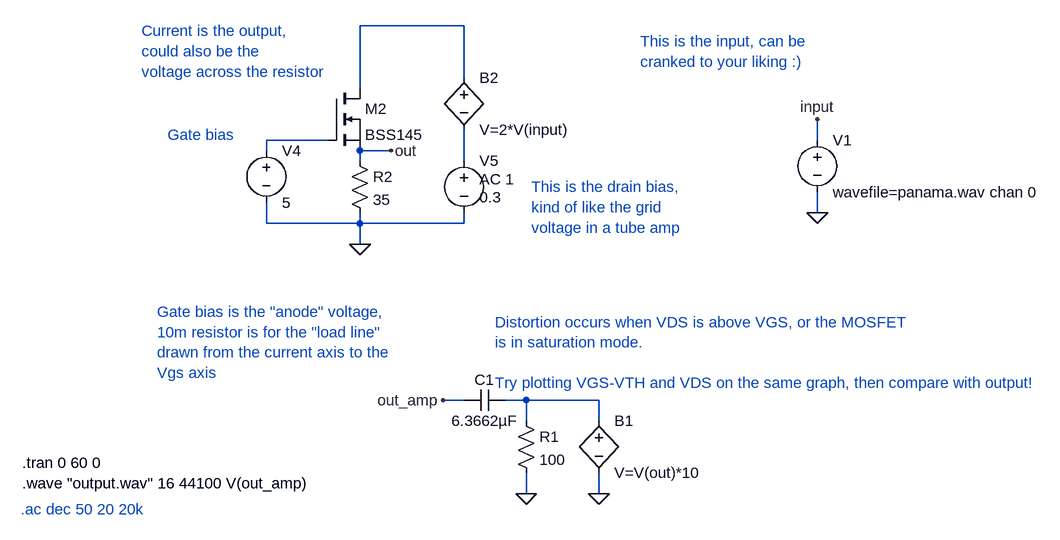
[diagram p0: schematic BSS145.asc]
BSS145.asc, the LTspice schematic file:
Version 4
SHEET 1 2308 808
WIRE 1360 48 1200 48
WIRE 1360 128 1360 48
WIRE 1200 144 1200 48
WIRE 1152 224 1056 224
WIRE 1904 224 1904 192
WIRE 1056 240 1056 224
WIRE 1248 240 1200 240
WIRE 1200 256 1200 240
WIRE 1360 256 1360 208
WIRE 1904 336 1904 304
WIRE 1056 352 1056 320
WIRE 1200 352 1200 336
WIRE 1200 352 1056 352
WIRE 1360 352 1360 336
WIRE 1360 352 1200 352
WIRE 1200 384 1200 352
WIRE 1360 624 1328 624
WIRE 1456 624 1424 624
WIRE 1568 624 1456 624
WIRE 1456 656 1456 624
WIRE 1568 656 1568 624
WIRE 1456 768 1456 736
WIRE 1568 768 1568 736
FLAG 1200 384 0
FLAG 1248 240 out
FLAG 1568 768 0
FLAG 1328 624 out_amp
FLAG 1456 768 0
FLAG 1904 336 0
FLAG 1904 192 input
SYMBOL nmos 1152 144 R0
SYMATTR InstName M2
SYMATTR Value BSS145
SYMBOL voltage 1056 224 R0
WINDOW 123 0 0 Left 0
WINDOW 39 0 0 Left 0
SYMATTR InstName V4
SYMATTR Value 5
SYMBOL voltage 1360 240 R0
WINDOW 123 24 44 Left 2
WINDOW 39 0 0 Left 0
WINDOW 3 24 72 Left 2
SYMATTR Value2 AC 1
SYMATTR Value 0.3
SYMATTR InstName V5
SYMBOL res 1184 240 R0
SYMATTR InstName R2
SYMATTR Value 35
SYMBOL bv 1568 640 R0
SYMATTR InstName B1
SYMATTR Value V=V(out)*10
SYMBOL res 1440 640 R0
SYMATTR InstName R1
SYMATTR Value 100
SYMBOL cap 1424 608 R90
WINDOW 0 0 32 VBottom 2
WINDOW 3 32 32 VTop 2
SYMATTR InstName C1
SYMATTR Value 6.3662µF
SYMBOL voltage 1904 208 R0
SYMATTR InstName V1
SYMATTR Value wavefile=panama.wav chan 0
SYMBOL bv 1360 112 R0
SYMATTR InstName B2
SYMATTR Value V=2*V(input)
TEXT 680 720 Left 2 !.tran 0 60 0
TEXT 1464 296 Left 2 ;This is the drain bias,\nkind of like the grid\nvoltage in a tube amp
TEXT 1632 72 Left 2 ;This is the input, can be\ncranked to your liking :)
TEXT 864 56 Left 2 ;Current is the output,\ncould also be the \nvoltage across the resistor
TEXT 904 216 Left 2 ;Gate bias
TEXT 888 488 Left 2 ;Gate bias is the "anode" voltage,\n10m resistor is for the "load line"\ndrawn from the current axis to the\nVgs axis
TEXT 1408 504 Left 2 ;Distortion occurs when VDS is above VGS, or the MOSFET\nis in saturation mode.\n \nTry plotting VGS-VTH and VDS on the same graph, then compare with output!
TEXT 680 752 Left 2 !.wave "output.wav" 16 44100 V(out_amp)
TEXT 678 792 Left 2 ;.ac dec 50 20 20k

The netlist it stands for:
* BSS145.asc
M2 N001 N002 out out BSS145
V4 N002 0 5
V5 N003 0 0.3 AC 1
R2 out 0 35
B1 N004 0 V=V(out)*10
R1 N004 0 100
C1 N004 out_amp 6.3662µF
V1 input 0 wavefile=panama.wav chan 0
B2 N001 N003 V=2*V(input)
.model NMOS NMOS
.model PMOS PMOS
.lib standard.mos
.tran 0 60 0
* This is the drain bias,
* kind of like the grid
* voltage in a tube amp
* This is the input, can be
* cranked to your liking :)
* Current is the output,
* could also be the
* voltage across the resistor
* Gate bias
* Gate bias is the "anode" voltage,
* 10m resistor is for the "load line"
* drawn from the current axis to the
* Vgs axis
* Distortion occurs when VDS is above VGS, or the MOSFET
* is in saturation mode.
* Try plotting VGS-VTH and VDS on the same graph, then compare with output!
.wave "output.wav" 16 44100 V(out_amp)
* .ac dec 50 20 20k
.backanno
.end